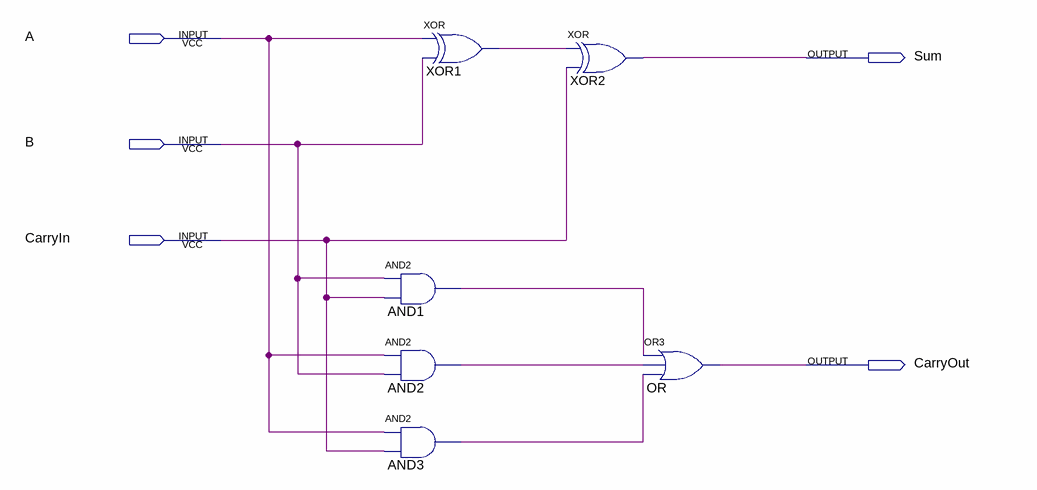
[diagram p0: schematic sheet]
// Quartus schematic Lab7_1.bdf as structural Verilog: 6 symbols, 5 pins
module Lab7_1 (
  input  A,
  input  B,
  input  CarryIn,
  output Sum,
  output CarryOut
);

  wire AND1_out, AND2_out, AND3_out, XOR1_out;

  xor XOR1 (XOR1_out, A, B);
  and AND1 (AND1_out, B, CarryIn);
  and AND2 (AND2_out, A, B);
  and AND3 (AND3_out, A, CarryIn);
  xor XOR2 (Sum, XOR1_out, CarryIn);
  or OR (CarryOut, AND1_out, AND2_out, AND3_out);
endmodule
